# EAGLE design receiver (EAGLE 7.3.0)
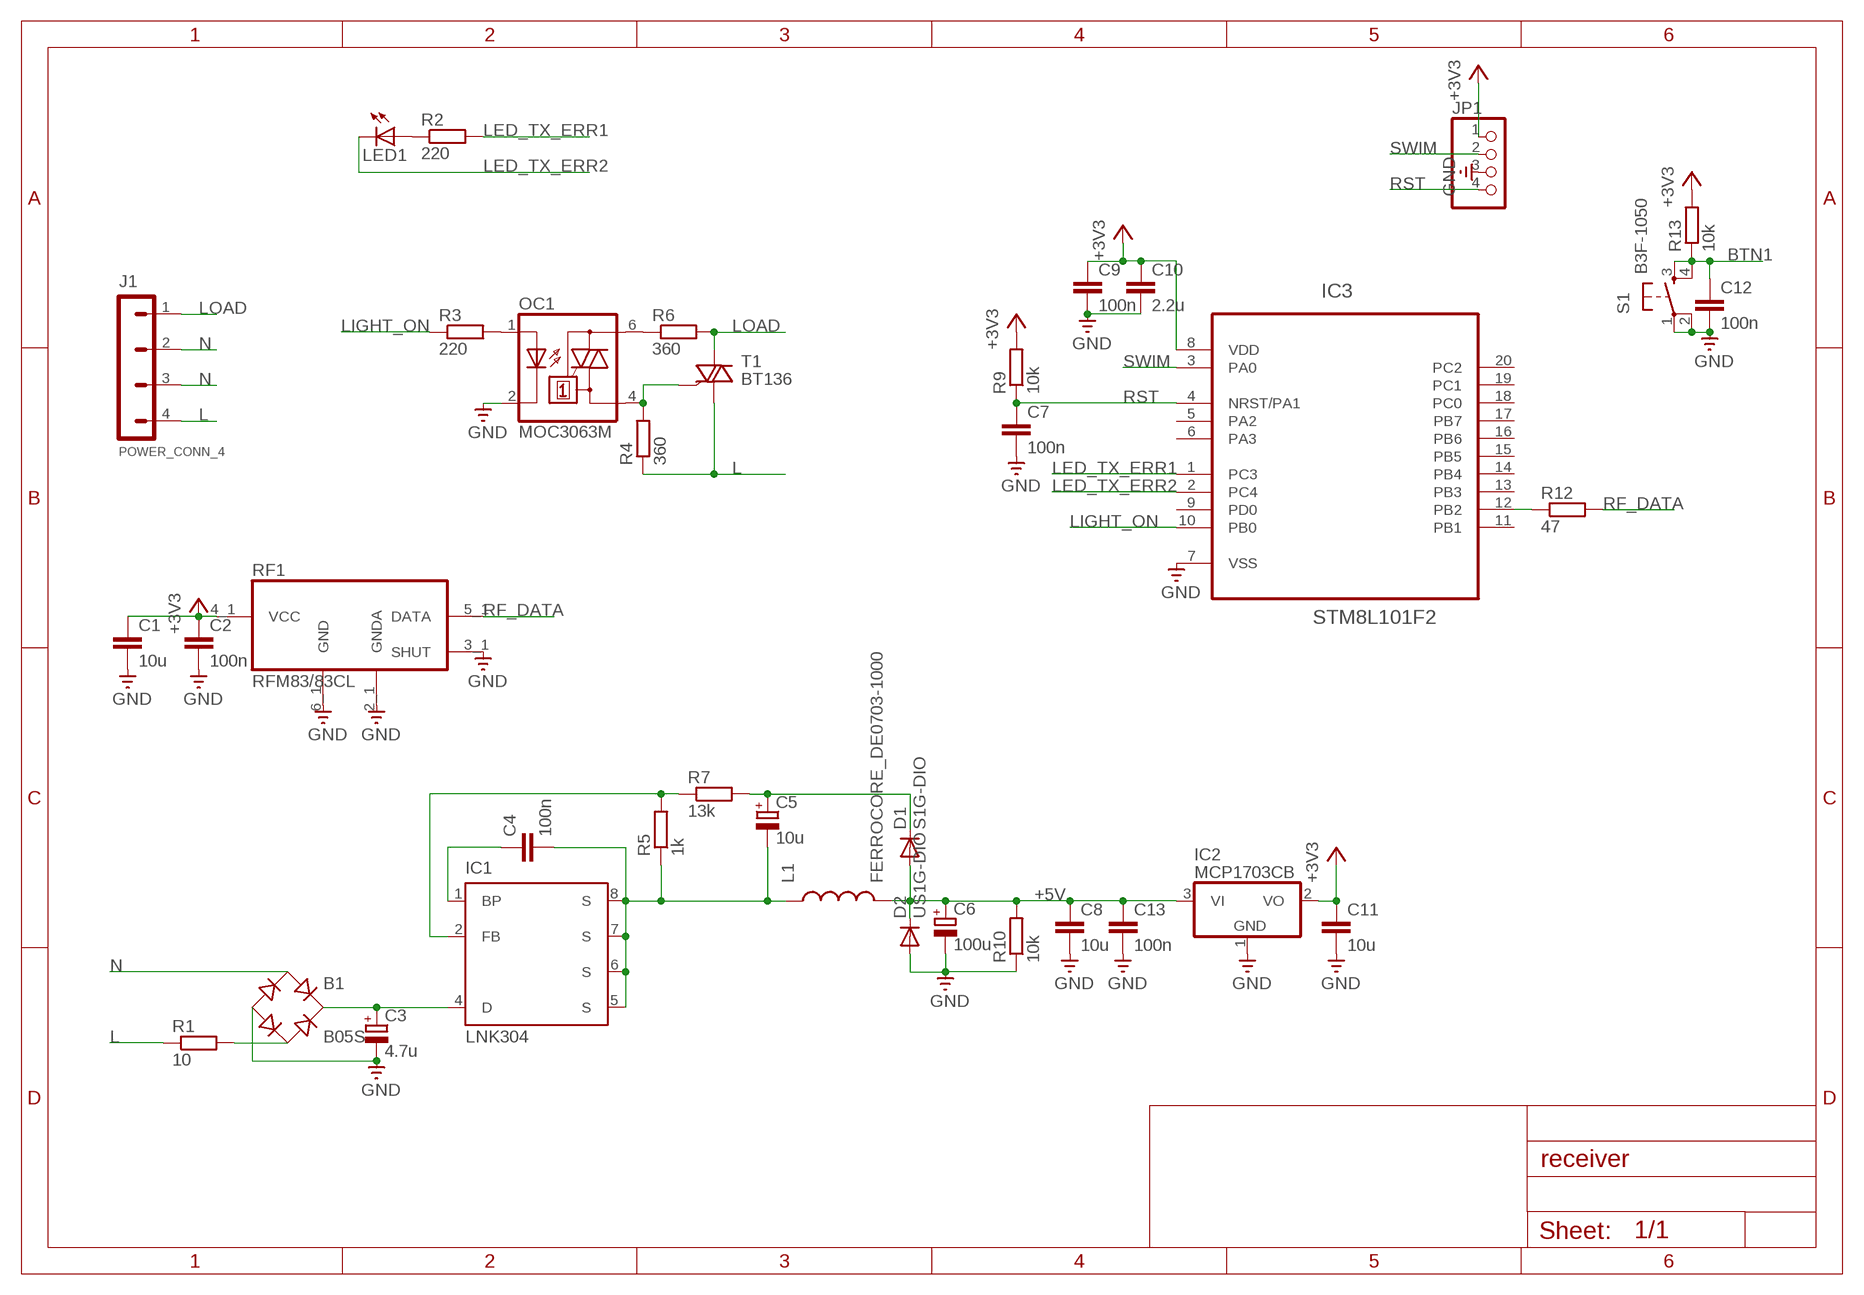
[diagram p0: schematic, sheet 1]

## Parts
B1  B05S  [MBS]
C1  10u  C-EUC0805K  [C0805K]
C2  100n  C-EUC0603K  [C0603K]
C3  4.7u  CPOL-EUE5-10.5  [E5-10,5]
C4  100n  C-EUC0603K  [C0603K]
C5  10u  CPOL-EUC  [PANASONIC_C]
C6  100u  CPOL-EUD  [PANASONIC_D]
C7  100n  C-EUC0603K  [C0603K]
C8  10u  C-EUC0805K  [C0805K]
C9  100n  C-EUC0603K  [C0603K]
C10  2.2u  C-EUC0805K  [C0805K]
C11  10u  C-EUC0805K  [C0805K]
C12  100n  C-EUC0603K  [C0603K]
C13  100n  C-EUC0603K  [C0603K]
D1  S1G-DIO  [DO214-AC]
D2  US1G-DIO  [DO214-AC]
IC1  LNK304  [SO8_NO_PIN3]
IC2  MCP1703CB  [SOT23]
IC3  STM8L101F2  [TSSOP20]
J1  POWER_CONN_4  [TERMINAL_BLOCK_4]
JP1  PINHD-1X4  [1X04]
L1  FERROCORE_DE0703-1000  [DE0703]
LED1  LED3MM  [LED3MM]
OC1  MOC3063M  MOC3023M  [DIL06]
R1  10  R-EU_0309/10  [0309/10]
R2  220  R-EU_R0603  [R0603]
R3  220  R-EU_R0603  [R0603]
R4  360  R-EU_R0805  [R0805]
R5  1k  R-EU_R0603  [R0603]
R6  360  R-EU_R0805  [R0805]
R7  13k  R-EU_R0603  [R0603]
R9  10k  R-EU_R0603  [R0603]
R10  10k  R-EU_R0603  [R0603]
R12  47  R-EU_R0603  [R0603]
R13  10k  R-EU_R0603  [R0603]
RF1  RFM83/83CL  [RFM83C/83CL_CONN]
S1  B3F-1050  DTS-6  [DTS-6]
T1  BT136  [TO220AB]

## Nets
+3V3: C1.1 C2.1 C9.1 C10.1 C11.1 IC2.2(VO) IC3.8(VDD) JP1.1 R9.2 R13.2 RF1.4_1(VCC)
+5V: C6.+ C8.1 C13.1 D1.A D2.C IC2.3(VI) L1.P$2 R10.2
BTN1: C12.1 R13.1 S1.3 S1.4
GND: B1.- C1.2 C2.2 C3.- C6.- C7.2 C8.2 C9.2 C10.2 C11.2 C12.2 C13.2 D2.A IC2.1(GND) IC3.7(VSS) JP1.3 OC1.2(C) R10.1 RF1.2_1(GNDA) RF1.3_1(SHUT) RF1.6_1(GND) S1.1 S1.2
L: J1.4 R1.1 R4.1 T1.1(A1)
LED_TX_ERR1: IC3.1(PC3) R2.2
LED_TX_ERR2: IC3.2(PC4) LED1.K(C)
LIGHT_ON: IC3.10(PB0) R3.1
LOAD: J1.1 R6.2 T1.2(A2)
N: B1.AC1 J1.2 J1.3
N$1: B1.+ C3.+ IC1.4(D)
N$2: LED1.A R2.1
N$3: C5.+ D1.C R7.2
N$4: IC1.2(FB) R5.2 R7.1
N$5: C4.1 IC1.1(BP)
N$6: C4.2 C5.- IC1.5(S) IC1.6(S) IC1.7(S) IC1.8(S) L1.P$1 R5.1
N$7: OC1.6(A2) R6.1
N$8: OC1.4(A1) R4.2 T1.3(G)
N$9: IC3.12(PB2) R12.1
N$10: B1.AC2 R1.2
N$11: OC1.1(A) R3.2
RF_DATA: R12.2 RF1.5_1(DATA)
RST: C7.1 IC3.4(NRST/PA1) JP1.4 R9.1
SWIM: IC3.3(PA0) JP1.2
Unconnected: IC3.5(PA2) IC3.6(PA3) IC3.9(PD0) IC3.11(PB1) IC3.13(PB3) IC3.14(PB4) IC3.15(PB5) IC3.16(PB6) IC3.17(PB7) IC3.18(PC0) IC3.19(PC1) IC3.20(PC2)

## Library data of the parts
B1 = rectifier:B*S: Surface Mount Glass Passivated Bridge Rectifiers Source: Comchip Bridge Rectifiers B05S-G_B10S-G.pdf
C1 C2 C4 C7-C13 = resistor:C-EU: CAPACITOR, European symbol
C3 C5 C6 = resistor:CPOL-EU: POLARIZED CAPACITOR, European symbol
D1 = comp_RFSwitch_v3:S1G-DIO
D2 = comp_RFSwitch_v3:US1G-DIO
IC1 = comp_RFSwitch_v3:LNK304
IC2 = linear:MCP1703: 250 mA, 16V, Low Quiescent Current LDO Regulator Source: http://ww1.microchip.com/downloads/en/DeviceDoc/22049b.pdf
IC3 = comp_RFSwitch_v3:STM8L101F2
J1 = CarReceiver:POWER_CONN_4
JP1 = pinhead:PINHD-1X4: PIN HEADER
L1 = comp_RFSwitch_v3:FERROCORE_DE0703-1000
LED1 = led:LED: LED OSRAM: - CHIPLED LG R971, LG N971, LY N971, LG Q971, LY Q971, LO R971, LY R971 LH N974, LH R974 LS Q976, LO Q976, LY Q976 LO Q996 - Hyper CHIPLED LW Q18S LB Q993, LB Q99A, LB R99A - SideLED LS A670, LO A670, LY A670, LG A670, LP A670 LB A673, LV A673, LT A673, LW A673 LH A674 LY A675 LS A676, LA A676, LO A676, LY A676, LW A676 LS A679, LY A679, LG A679 - Hyper Micro SIDELED® LS Y876, LA Y876, LO Y876, LY Y876 LT Y87S - SmartLED LW L88C, LW L88S LB L89C, LB L89S, LG L890 LS L89K, LO L89K, LY L89K LS L896, LA L896, LO L896, LY L896 - TOPLED LS T670, LO T670, LY T670, LG T670, LP T670 LSG T670, LSP T670, LSY T670, LOP T670, LYG T670 LG T671, LOG T671, LSG T671 LB T673, LV T673, LT T673, LW T673 LH T674 LS T676, LA T676, LO T676, LY T676, LB T676, LH T676, LSB T676, LW T676 LB T67C, LV T67C, LT T67C, LS T67K, LO T67K, LY T67K, LW E67C LS E67B, LA E67B, LO E67B, LY E67B, LB E67C, LV E67C, LT E67C LW T67C LS T679, LY T679, LG T679 LS T770, LO T770, LY T770, LG T770, LP T770 LB T773, LV T773, LT T773, LW T773 LH T774 LS E675, LA E675, LY E675, LS T675 LS T776, LA T776, LO T776, LY T776, LB T776 LHGB T686 LT T68C, LB T68C - Hyper Mini TOPLED® LB M676 - Mini TOPLED Santana® LG M470 LS M47K, LO M47K, LY M47K Source: http://www.osram.convergy.de LUXEON: - LUMILED® LXK2-PW12-R00, LXK2-PW12-S00, LXK2-PW14-U00, LXK2-PW14-V00 LXK2-PM12-R00, LXK2-PM12-S00, LXK2-PM14-U00 LXK2-PE12-Q00, LXK2-PE12-R00, LXK2-PE12-S00, LXK2-PE14-T00, LXK2-PE14-U00 LXK2-PB12-K00, LXK2-PB12-L00, LXK2-PB12-M00, LXK2-PB14-N00, LXK2-PB14-P00, LXK2-PB14-Q00 LXK2-PR12-L00, LXK2-PR12-M00, LXK2-PR14-Q00, LXK2-PR14-R00 LXK2-PD12-Q00, LXK2-PD12-R00, LXK2-PD12-S00 LXK2-PH12-R00, LXK2-PH12-S00 LXK2-PL12-P00, LXK2-PL12-Q00, LXK2-PL12-R00 Source: www.luxeon.com KINGBRIGHT: KA-3528ASYC Source: www.kingbright.com
OC1 = optocoupler:MOC30*M: RANDOM-PHASE OPTOISOLATORS TRIAC DRIVER OUTPUT Source: http://www.fairchildsemi.com MOC3020-M.pdf; MF: FAIRCHILD SEMICONDUCTOR; MPN: MOC3023-M; OC_FARNELL: 1021367; OC_NEWARK: 72K8896
R1-R7 R9 R10 R12 R13 = resistor:R-EU_: RESISTOR, European symbol
RF1 = comp_RFSwitch_v3:RFM83/83CL
S1 = switch-tact:DTS-6
T1 = triac:BT136: Triac BT136 series E sensitive gate Source: http://www.nxp.com/acrobat_download/datasheets/BT136_SERIES_E_2.pdf

## Board
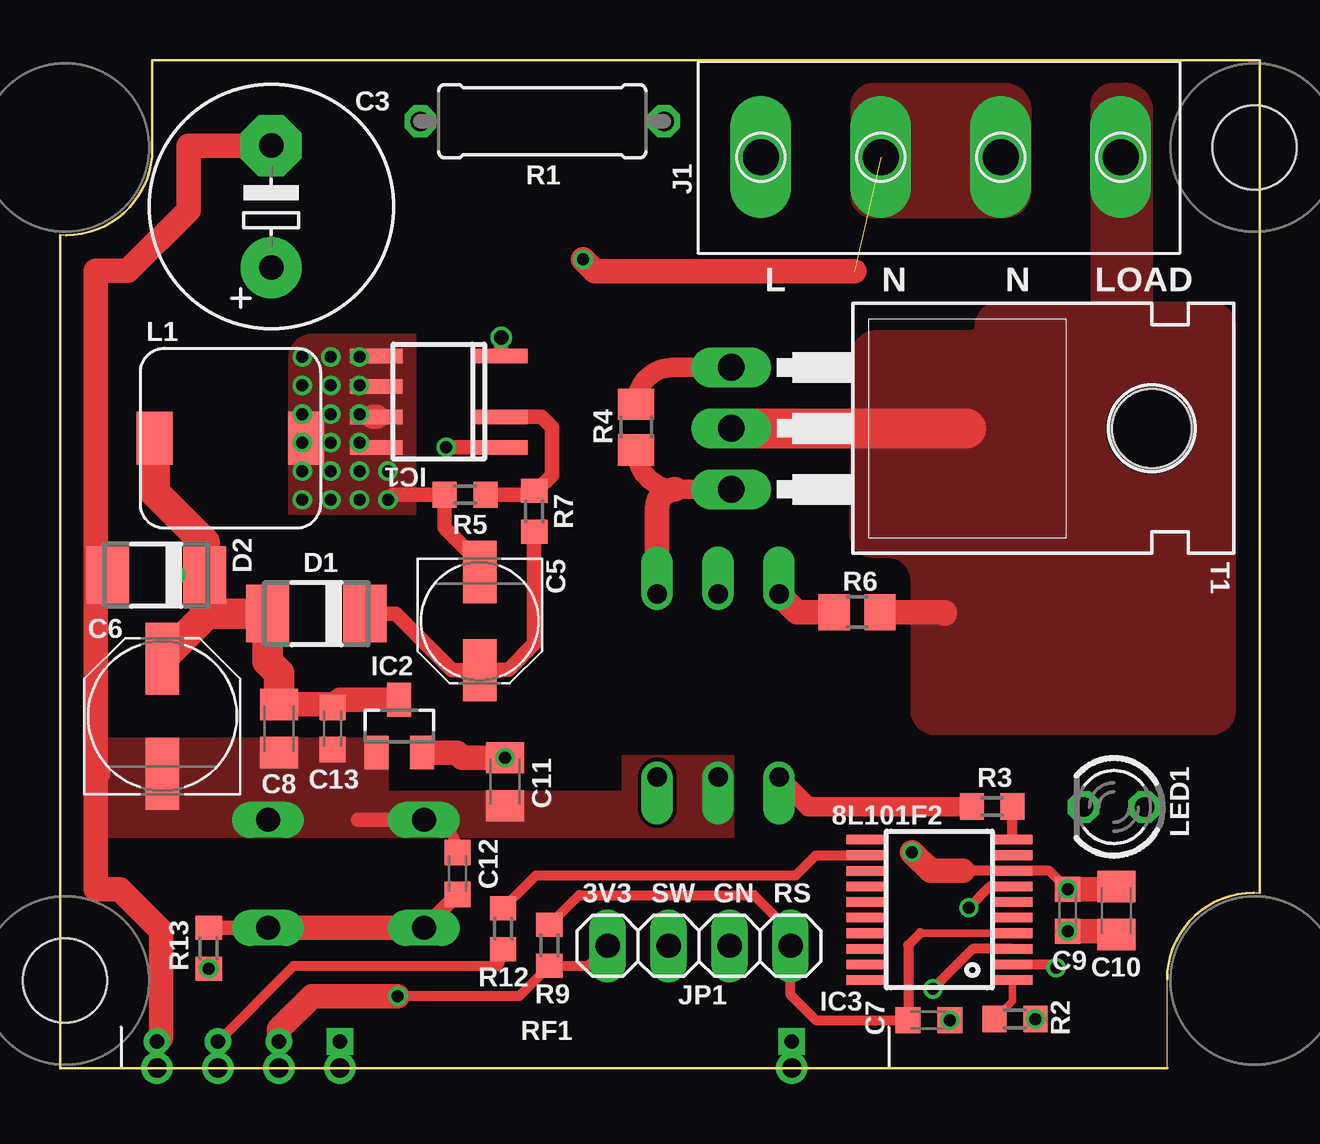
[diagram p1: board, top side]
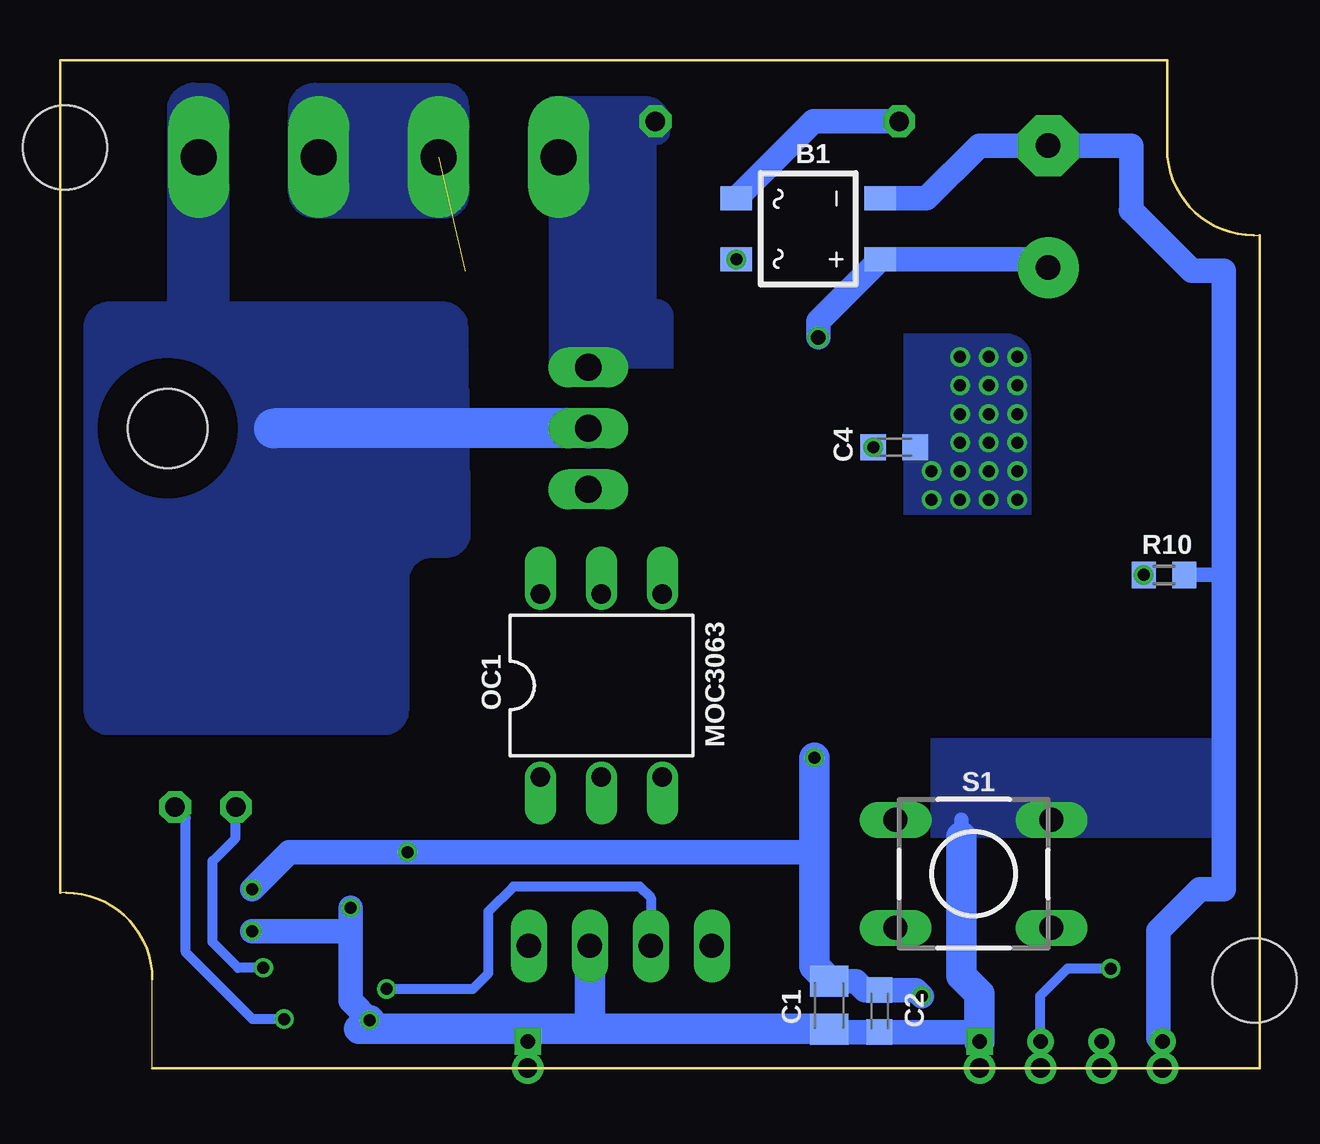
[diagram p2: board, bottom side, seen from below]

Size 50 x 42 mm. Coordinates in mm from the lower left corner, seen from the top.
Outline: 3.85,42 3.85,38.3 arc-90 0.25,34.7 0,34.7 0,0 46.15,0 46.15,3.7 arc-90 49.75,7.3 50,7.3 50,42 3.85,42
Copper layers (1*16): Top 0.035mm / dielectric 1.5mm / Bottom 0.035mm
Design rules "SeeedStudio_2layer_DRU_no_angle_20140221": minimum track width 6mil, minimum drill 12mil, track to track 6mil, track to pad 6mil, pad to pad 6mil, via to via 6mil, smd to smd 0mil, copper to edge 10mil, drill to drill 10mil, minimum pad ring 10mil, minimum via ring 6mil, stop-mask expansion 2mil, vias tented up to drill 100mil, thermal gap 10mil
Holes 3.5 mm at 49.8,38.35 0.2,3.65

### Footprints (pad centres in the part's own frame; a part is rotated, then mirrored left to right if it is on the bottom)
MBS = smd 1 x 1.3: + -1.27,-3; - 1.27,-3; AC1 -1.27,3; AC2 1.27,3
C0805K = smd 1.3 x 1.6: 1 -1,0; 2 1,0
C0603K = smd 1.05 x 1.08: 1 -0.875,0; 2 0.875,0
E5-10,5 = drill 1.016 pad 2.54: + -2.54,0 | drill 1.016 pad 2.54 octagon: - 2.54,0
PANASONIC_C = smd 2.6 x 1.4: + 2.05,0; - -2.05,0
PANASONIC_D = smd 3 x 1.4: + 2.4,0; - -2.4,0
DO214-AC = smd 1.8 x 2.4: A 2.025,0; C -2.025,0
SO8_NO_PIN3 = smd 0.6 x 2.2: 1 -1.905,-2.6; 2 -0.635,-2.6; 4 1.905,-2.6; 5 1.905,2.6; 6 0.635,2.6; 7 -0.635,2.6; 8 -1.905,2.6
SOT23 = smd 1 x 1.4: 1 -0.95,-1.1; 2 0.95,-1.1; 3 0,1.1
TSSOP20 = smd 0.4 x 1.65: 1 -3.575,-3.05; 2 -2.925,-3.05; 3 -2.275,-3.05; 4 -1.625,-3.05; 5 -0.975,-3.05; 6 -0.325,-3.05; 7 0.325,-3.05; 8 0.975,-3.05; 9 1.625,-3.05; 10 2.275,-3.05; 11 2.275,3.05; 12 1.625,3.05; 13 0.975,3.05; 14 0.325,3.05; 15 -0.325,3.05; 16 -0.975,3.05; 17 -1.625,3.05; 18 -2.275,3.05; 19 -2.925,3.05; 20 -3.575,3.05
TERMINAL_BLOCK_4 = drill 1.5 pad 2.54 long: 1 0,7.58; 2 0,2.58; 3 0,-2.42; 4 0,-7.42
1X04 = drill 1.016 long: 1 -3.81,0; 2 -1.27,0; 3 1.27,0; 4 3.81,0
DE0703 = smd 2.2 x 1.5: P$1 0,3.15; P$2 0,-3.15
LED3MM = drill 0.813 octagon: A -1.27,0; K 1.27,0
DIL06 = drill 0.813 offset: 1 -2.54,-3.81; 2 0,-3.81; 3 2.54,-3.81; 4 2.54,3.81; 5 0,3.81; 6 -2.54,3.81
0309/10 = drill 0.813 octagon: 1 -5.08,0; 2 5.08,0
R0603 = smd 1 x 1.1: 1 -0.85,0; 2 0.85,0
R0805 = smd 1.3 x 1.5: 1 -0.95,0; 2 0.95,0
RFM83C/83CL_CONN = drill 0.8: 2 2.54,-1.1; 3 21.38,-1.1; 4 23.92,-1.1; 5 26.46,-1.1; 6 29,-1.1 | drill 0.6 square: 2_1 2.54,0; 3_1 21.38,0 | drill 0.6: 4_1 23.92,0; 5_1 26.46,0; 6_1 29,0
DTS-6 = drill 1 long: 1 -3.25,2.25; 2 3.25,2.25; 3 -3.25,-2.25; 4 3.25,-2.25
TO220AB = drill 1.118 long: 1 -2.54,-6.35; 2 0,-6.35; 3 2.54,-6.35 | hole 3.302: 0,11.176

### Placement (x,y rotation side)
B1  18.81,34.96 90 bottom
C1  17.93,2.61 270 bottom
C2  15.84,2.37 270 bottom
C3  8.81,35.89 90 top
C4  15.23,25.86 0 bottom
C5  17.5,18.62 270 top
C6  4.27,14.66 90 top
C7  36.22,1.99 0 top
C8  9.13,14.15 270 top
C9  42,6.58 270 top
C10  44.03,6.56 270 top
C11  18.55,11.93 270 top
C12  16.57,8.1 90 top
C13  11.36,14.15 270 top
D1  10.68,18.93 180 top
D2  4.01,20.54 180 top
IC1  15.79,27.77 90 top
IC2  14.14,14.24 0 top
IC3  36.66,7.24 90 top
J1  36.63,37.95 270 top
JP1  26.64,5.09 0 top
L1  7.11,26.24 270 top
LED1  43.93,10.88 180 top
OC1  27.43,15.93 0 bottom
R1  20.1,39.45 180 top
R2  39.8,2.04 180 top
R3  38.85,10.89 180 top
R4  24.02,26.7 270 top
R5  16.89,23.89 0 top
R6  33.22,19 0 top
R7  19.77,23.2 270 top
R9  20.4,5.11 270 top
R10  3.98,20.54 180 bottom
R12  18.47,5.8 270 top
R13  6.2,4.99 270 top
RF1  33.05,1.1 0 bottom
S1  11.92,8.09 0 bottom
T1  34.33,26.65 270 top

### Tracks (layer width: path | path; a pad name or v marks a point on that pad's centre or on a via)
+3V3  (via drill 0.5)
  Top 0.406: IC3.8 37.63,8.21 | C9.1 41.24,8.21 39.65,8.21 | JP1.1 22,4.26 R9.2 19.14,3 v14.08,3
  Top 1.016: C9.1 43.92,7.45 C10.1 | 37.63,8.21 36.3,8.21 v35.51,9 | IC2.2 16.54,13.14 16.77,12.92 C11.1 | RF1.4_1 9.14,1.12 9.14,1.63 10.51,3 v14.08,3
  Bottom 0.406: 23.33,8.97 23.3,9 | R13.2 8,4.14 9.16,2.99 9.16,1.13 RF1.4_1
  Bottom 1.016: C9.1 40.45,9 v35.51,9 23.3,9 18.7,9 18.55,8.85 | C1.1 16.82,3.61 16.45,3.25 C2.1 14.33,3.25 v14.08,3
  Bottom 1.27: C11.1 18.55,8.85 18.55,4.23 C1.1
  other vias: 42,7.45 6.2,4.14 18.55,12.93
+5V  (via drill 0.5)
  Top 0.406: R10.2 D2.C
  Top 1.016: C8.1 11.23,15.15 C13.1 11.68,15.34 IC2.3
  Top 1.27: L1.P$2 3.96,23.98 6.04,21.91 D2.C 6.04,18.93 | C6.+ 6.04,18.83 6.04,18.93 | 6.04,18.93 D1.A 8.66,16.93 9.13,16.46 C8.1
  other vias: 4.83,20.54
BTN1
  Top 0.406: 6.41,5.84 R13.1
  Top 0.61: C12.1 16.55,7.23 S1.3 | S1.4 R13.1
  Top 1.016: S1.4 S1.3
GND  (via drill 0.5)
  Top 0.406: v37.88,6.68 38.77,7.56 IC3.7 | C12.2 arc90 15.21,10.34
  Top 0.61: 12.42,10.34 15.21,10.34
  Top 0.813: 1.7,12.26 1.49,12.05
  Top 1.016: C9.2 43.89,5.7 C10.2 | 1.49,20.49 1.49,33.21 2.82,33.21 5.36,35.75 5.36,38.43 C3.- | 1.49,20.49 1.49,12.05 1.49,7.44 2.48,7.44 4.21,5.71 4.21,1.27 RF1.6_1 | D2.A 1.54,20.54 1.49,20.49
  Bottom 0.61: R10.1 1.57,20.54 arc-90 1.49,20.62 | 12.42,9.64 12.42,10.34
  Bottom 0.813: RF1.2_1 30.51,1.59 30.47,1.63
  Bottom 1.016: v37.88,6.68 37.88,5.86 | 37.88,5.86 37.88,2.81 C7.2 | B1.- 13.88,36.23 11.69,38.43 C3.- 5.35,38.43 5.35,35.74 | C9.2 38.04,5.7 37.88,5.86 | RF1.3_1 12.06,1.5 C2.2 17.82,1.5 17.95,1.63 | 5.36,35.75 5.35,35.74 | 5.35,35.74 2.82,33.21 1.49,33.21 1.49,20.62 1.49,7.44 2.48,7.44 4.21,5.71 4.21,1.27 4.06,1.11
  Bottom 1.27: C7.2 37.53,1.63 30.47,1.63 28.12,1.63 | RF1.3_1 11.67,3.1 12.42,3.85 12.42,9.64 | 28.12,1.63 17.95,1.63 C1.2 | JP1.3 27.91,1.83 28.12,1.63
  other vias: 37.09,1.99 42,5.7
  pour Top (no thermals): 1.04,13.71 13.65,13.71 13.65,11.52 23.46,11.52 23.46,13 28.05,13 28.05,9.64 1.04,9.64
  pour Bottom (no thermals): 1.04,13.71 13.65,13.71 13.65,9.64 2.72,9.64 1.04,9.64
L
  Top 0.813: T1.1 25.55,29.19 arc90 R4.1
  pour Bottom (no thermals): 29.57,40.44 25.61,40.44 arc90 24.61,39.44 24.61,39.06 arc90 25.17,38.5 25.17,32 arc90 24.47,31.3 24.47,29.2 29.57,29.2
LED_TX_ERR1
  Top 0.305: IC3.1 39.7,2.79 R2.2
LED_TX_ERR2  (via drill 0.5)
  Top 0.406: IC3.2 41.23,4.32 41.37,4.17 v41.53,4.17
  Bottom 0.406: v41.53,4.17 42.57,4.17 43.64,5.24 43.64,8.62 42.69,9.57 42.69,10.85 LED1.K
LIGHT_ON
  Top 0.406: IC3.10 R3.1
LOAD
  Top 1.016: 34.17,26.63 arc-90 34.2,26.65 | R6.2 36.88,19 36.88,18.93
  Top 1.676: T1.2 34.2,26.65 37.77,26.65
  Bottom 1.676: T1.2 41.07,26.65
  pour Bottom: 48.97,14.92 48.97,30.88 arc90 47.97,31.88 34.04,31.88 arc89 33.04,30.89 32.92,22.31 arc91 33.92,21.3 34.5,21.3 arc-90 35.5,20.3 35.5,14.92 arc90 36.5,13.92 47.97,13.92 arc90
  pour Top: 35.5,14.92 35.5,20.3 arc90 34.5,21.3 33.94,21.3 arc-91 32.94,22.31 33.04,29.71 arc-89 34.04,30.7 37.99,30.7 arc90 38.17,30.88 arc-90 39.17,31.88 47.97,31.88 arc-90 48.97,30.88 48.97,14.92 arc-90 47.97,13.92 36.5,13.92 arc-90
  pour Top (no thermals): 43,31.38 43,40 arc-90 43.84,41 44.28,41 arc-90 45.5,40 45.5,31.38
  pour Bottom (no thermals): 45.5,31.38 45.5,40 arc90 44.28,41 43.84,41 arc90 43,40 43,31.38
N  (via drill 0.5)  (1 unrouted)
  Top 1.016: 33.12,33.2 22.3,33.2 B1.AC1
  other vias: 21.81,33.69
  pour Top (no thermals): 33,36.46 33,40 arc-90 33.84,41 39.27,41 arc-90 40.45,40 40.45,36.46 arc-90 39.27,35.46 33.84,35.46 arc-90
  pour Bottom (no thermals): 39.27,35.46 33.84,35.46 arc-90 33,36.46 33,40 arc-90 33.84,41 39.27,41 arc-90 40.45,40 40.45,36.46 arc-90
N$1  (via drill 0.6)
  Top 0.61: IC1.4 v18.39,30.44
  Bottom 1.016: v18.39,30.44 18.39,31.11 B1.+ 9.15,33.69 C3.+
N$2  (via drill 0.5)
  Bottom 0.406: R2.1 41.98,2.04 44.75,4.82 44.75,10.43 LED1.A
  other vias: 40.66,2.04
N$3
  Top 0.61: R7.2 19.77,17.67 18.69,16.59 17.52,16.59 C5.+ 16.34,16.58 13.98,18.93 D1.C
N$4
  Top 0.61: IC1.2 20.07,27.13 20.5,26.7 20.5,24.7 19.85,24.05 R7.1 | 19.87,23.86 R7.1 | R5.2 19.6,23.89 R7.1
N$5  (via drill 0.5)
  Top 0.61: IC1.1 | IC1.1 | IC1.1 16.64,25.86 arc45 16.64,25.86 C4.1
  other vias: 16.1,25.86
N$6  (via drill 0.5)
  Top 0.406: IC1.5
  Top 0.61: IC1.8 | C5.- 17.5,21.05 16.04,22.51 R5.1 13.88,23.89 v13.67,23.68
  Top 1.016: 13.06,27.13 IC1.7
  Bottom 0.61: C4.2 arc-45 14.15,25.86 arc45 C4.2
  other vias: 10.1,23.68 11.29,23.68 12.48,23.68 12.48,29.63 12.48,24.87 12.48,26.06 12.48,27.25 12.48,28.44 13.67,24.87 10.1,29.63 10.1,24.87 10.1,26.06 10.1,27.25 10.1,28.44 11.29,29.63 11.29,24.87 11.29,26.06 11.29,27.25 11.29,28.44
  pour Top (no thermals): 14.8,23.1 9.56,23.1 9.56,29.56 arc-90 10.56,30.56 14.8,30.56
  pour Bottom (no thermals): 9.56,23.1 14.8,23.1 14.8,30.56 10.56,30.56 arc90 9.56,29.56
N$7
  Top 1.016: OC1.6 30.72,19 R6.1
N$8
  Top 0.813: T1.3 25.66,24.11 arc-90 R4.2 | 27.97,24.1 T1.3 | T1.3 | 28,24.1 T1.3
  Top 1.016: OC1.4 24.89,23.35 arc-90 25.66,24.11
N$9
  Top 0.406: R12.1 19.84,8.02 30.67,8.02 31.51,8.86 IC3.12
N$10
  Bottom 1.016: R1.2 18.6,39.45 B1.AC2
N$11
  Top 0.813: R3.2 31.2,10.89 OC1.1
RF_DATA
  Top 0.406: R12.2 18.26,4.24 9.73,4.24 RF1.5_1
RST
  Top 0.305: IC3.4 35.86,5.62 | 35.45,2.1 C7.1
  Top 0.406: 35.86,5.62 35.36,5.12 35.36,2.01 C7.1 31.5,1.99 30.45,3.04 JP1.4 30.45,5.68 28.93,7.2 21.64,7.2 R9.1
SWIM  (via drill 0.5)
  Top 0.406: IC3.3 38.06,4.96 v36.39,3.3
  Bottom 0.406: v36.39,3.3 32.79,3.3 32.14,3.95 32.14,6.52 31.1,7.56 25.84,7.56 25.37,7.09 JP1.2

### Text on the board
tPlace: L | N | N | LOAD | 8L101F2 | 3V3 | SW | GN | RS
bPlace: MOC3063